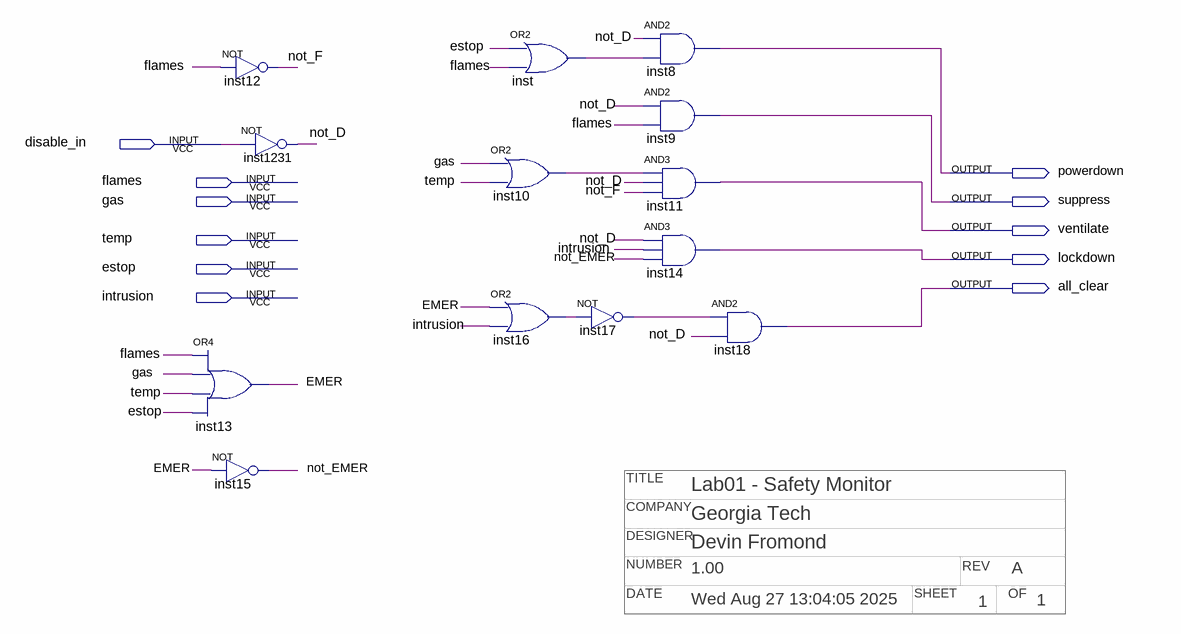
[diagram p0: schematic sheet]
// Quartus schematic SafetyMonitor.bdf as structural Verilog: 13 symbols, 11 pins
// Title block: COMPANY: Georgia Tech; DATE: Wed Aug 27 13:04:05 2025; DESIGNER: Devin Fromond; NUMBER: 1.00; OF: 1; REV: A; SHEET: 1; TITLE: Lab01 - Safety Monitor
module SafetyMonitor (
  input  disable_in,
  input  flames,
  input  gas,
  input  temp,
  input  estop,
  input  intrusion,
  output powerdown,
  output suppress,
  output ventilate,
  output lockdown,
  output all_clear
);

  wire EMER, inst10_out, inst16_out, inst17_out, inst_out, not_D, not_EMER, not_F;

  or inst13 (EMER, flames, gas, temp, estop);
  not inst12 (not_F, flames);
  not inst1231 (not_D, disable_in);
  not inst15 (not_EMER, EMER);
  or inst10 (inst10_out, gas, temp);
  or inst16 (inst16_out, EMER, intrusion);
  or inst (inst_out, estop, flames);
  not inst17 (inst17_out, inst16_out);
  and inst8 (powerdown, not_D, inst_out);
  and inst9 (suppress, not_D, flames);
  and inst11 (ventilate, inst10_out, not_D, not_F);
  and inst14 (lockdown, not_D, intrusion, not_EMER);
  and inst18 (all_clear, inst17_out, not_D);
endmodule
